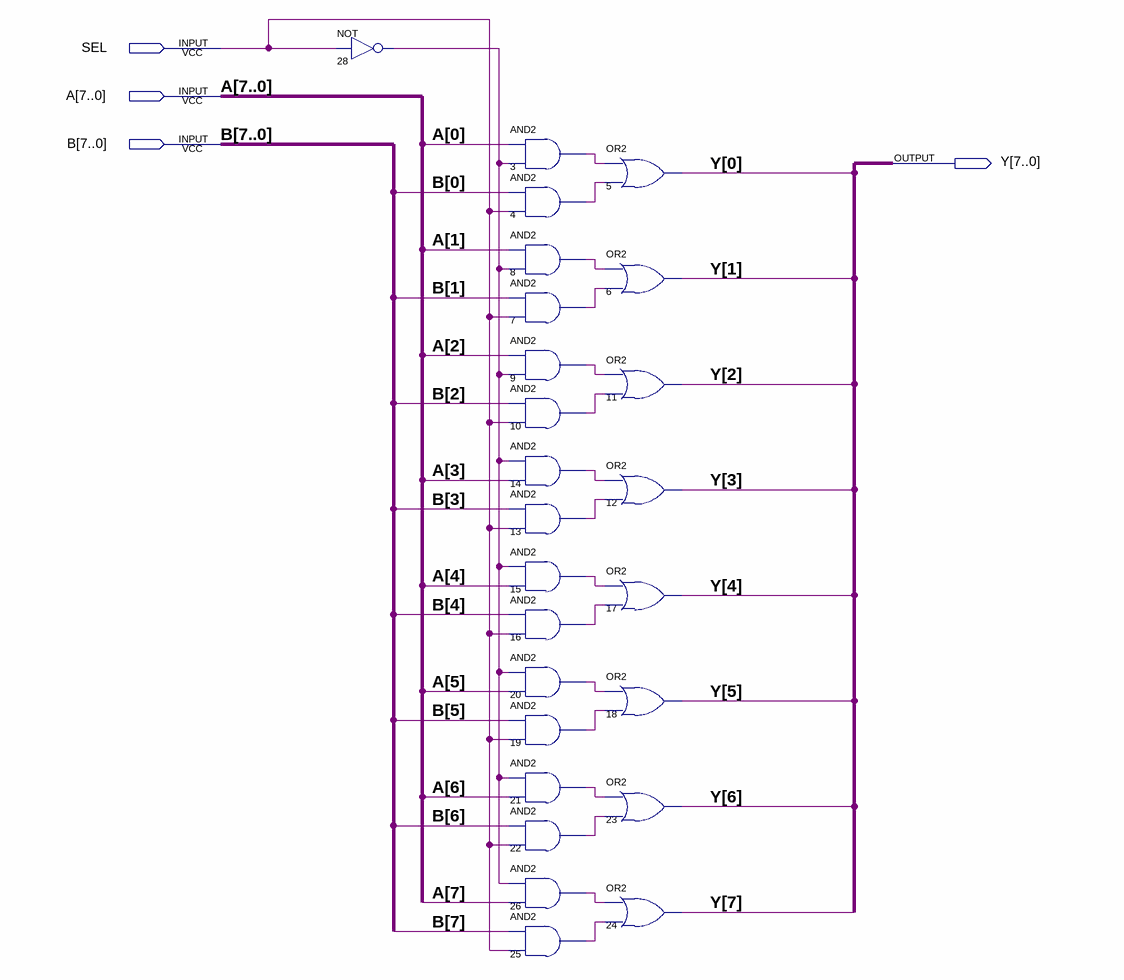
[diagram p0: schematic sheet]
// Quartus schematic 2x8mux.bdf as structural Verilog: 25 symbols, 4 pins
module \2x8mux  (
  input  SEL,
  input  [7:0] A,
  input  [7:0] B,
  output [7:0] Y
);

  wire n3_out, n4_out, n7_out, n8_out, n9_out, n10_out, n13_out, n14_out, n15_out, n16_out, n19_out, n20_out,
       n21_out, n22_out, n25_out, n26_out, n28_out;

  not u_28 (n28_out, SEL);
  and u_3 (n3_out, A[0], n28_out);
  and u_4 (n4_out, B[0], SEL);
  and u_8 (n8_out, A[1], n28_out);
  and u_7 (n7_out, B[1], SEL);
  and u_9 (n9_out, A[2], n28_out);
  and u_10 (n10_out, B[2], SEL);
  and u_14 (n14_out, n28_out, A[3]);
  and u_13 (n13_out, B[3], SEL);
  and u_15 (n15_out, n28_out, A[4]);
  and u_16 (n16_out, B[4], SEL);
  and u_20 (n20_out, n28_out, A[5]);
  and u_19 (n19_out, B[5], SEL);
  and u_21 (n21_out, n28_out, A[6]);
  and u_22 (n22_out, B[6], SEL);
  and u_26 (n26_out, n28_out, A[7]);
  and u_25 (n25_out, B[7], SEL);
  or u_5 (Y[0], n3_out, n4_out);
  or u_6 (Y[1], n8_out, n7_out);
  or u_11 (Y[2], n9_out, n10_out);
  or u_12 (Y[3], n14_out, n13_out);
  or u_17 (Y[4], n15_out, n16_out);
  or u_18 (Y[5], n20_out, n19_out);
  or u_23 (Y[6], n21_out, n22_out);
  or u_24 (Y[7], n26_out, n25_out);
endmodule
